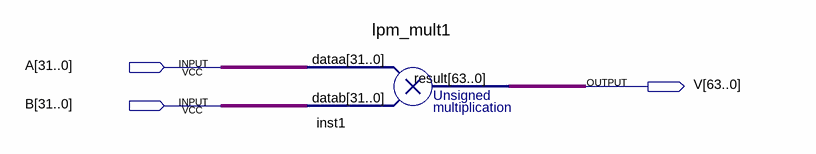
[diagram p0: schematic sheet]
// Quartus schematic sch1.bdf as structural Verilog: 1 symbols, 3 pins
module sch1 (
  input  [31:0] A,
  input  [31:0] B,
  output [63:0] V
);

  lpm_mult1 inst1 (.dataa(A), .datab(B), .result(V));
endmodule
